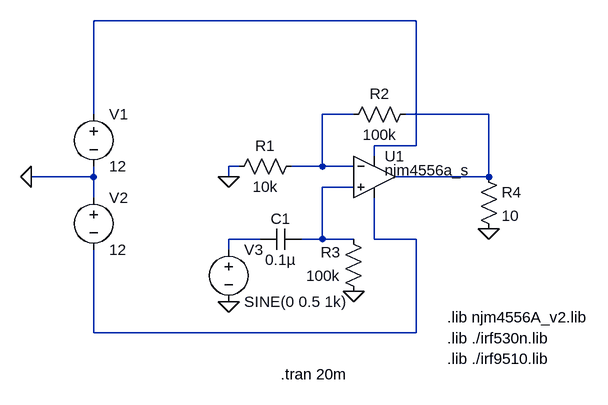
[diagram p0: schematic Q3.1.asc]
Q3.1.asc, the LTspice schematic file:
Version 4
SHEET 1 880 680
WIRE 528 -256 32 -256
WIRE 32 -112 32 -256
WIRE 432 -112 384 -112
WIRE 640 -112 512 -112
WIRE 528 -64 528 -256
WIRE 528 -64 464 -64
WIRE 464 -48 464 -64
WIRE 256 -32 240 -32
WIRE 384 -32 384 -112
WIRE 384 -32 336 -32
WIRE 432 -32 384 -32
WIRE 32 -16 32 -32
WIRE 32 -16 -64 -16
WIRE 240 -16 240 -32
WIRE 640 -16 640 -112
WIRE 640 -16 496 -16
WIRE 432 0 384 0
WIRE 32 16 32 -16
WIRE 288 80 240 80
WIRE 384 80 384 0
WIRE 384 80 352 80
WIRE 432 80 384 80
WIRE 464 80 464 16
WIRE 528 80 464 80
WIRE 240 96 240 80
WIRE 32 224 32 96
WIRE 528 224 528 80
WIRE 528 224 32 224
FLAG 240 -16 0
FLAG 240 176 0
FLAG 432 160 0
FLAG 640 64 0
FLAG -64 -16 0
SYMBOL Res 352 -48 R90
WINDOW 0 0 56 VBottom 2
WINDOW 3 32 56 VTop 2
SYMATTR InstName R1
SYMATTR Value 10k
SYMBOL Res 528 -128 R90
WINDOW 0 0 56 VBottom 2
WINDOW 3 32 56 VTop 2
SYMATTR InstName R2
SYMATTR Value 100k
SYMBOL Res 448 176 R180
WINDOW 0 36 76 Left 2
WINDOW 3 36 40 Left 2
SYMATTR InstName R3
SYMATTR Value 100k
SYMBOL Cap 352 64 R90
WINDOW 0 0 32 VBottom 2
WINDOW 3 32 32 VTop 2
SYMATTR InstName C1
SYMATTR Value 0.1µ
SYMBOL OpAmps/opamp2 464 -80 R0
WINDOW 3 16 96 Invisible 2
WINDOW 38 16 54 Left 2
SYMATTR InstName U1
SYMATTR SpiceModel njm4556a_s
SYMBOL Res 624 -32 R0
SYMATTR InstName R4
SYMATTR Value 10
SYMBOL Voltage 32 0 R0
SYMATTR InstName V2
SYMATTR Value 12
SYMBOL Voltage 240 80 R0
SYMATTR InstName V3
SYMATTR Value SINE(0 0.5 1k)
SYMBOL Voltage 32 -128 R0
SYMATTR InstName V1
SYMATTR Value 12
TEXT 576 200 Left 2 !.lib njm4556A_v2.lib
TEXT 576 232 Left 2 !.lib ./irf530n.lib
TEXT 576 264 Left 2 !.lib ./irf9510.lib
TEXT 320 288 Left 2 !.tran 20m

The netlist it stands for:
* Q3.1.asc
R1 N002 0 10k
R2 N003 N002 100k
R3 0 N004 100k
C1 N004 N005 0.1µ
XU1 N004 N002 N001 N006 N003 njm4556a_s opamp2  ; pins In+ In- V+ V- OUT
R4 N003 0 10
V2 0 N006 12
V3 N005 0 SINE(0 0.5 1k)
V1 N001 0 12
.lib njm4556A_v2.lib
.lib ./irf530n.lib
.lib ./irf9510.lib
.tran 20m
.backanno
.end